# EAGLE schematic h-bridge2-smd-001 (EAGLE 7.2.0)
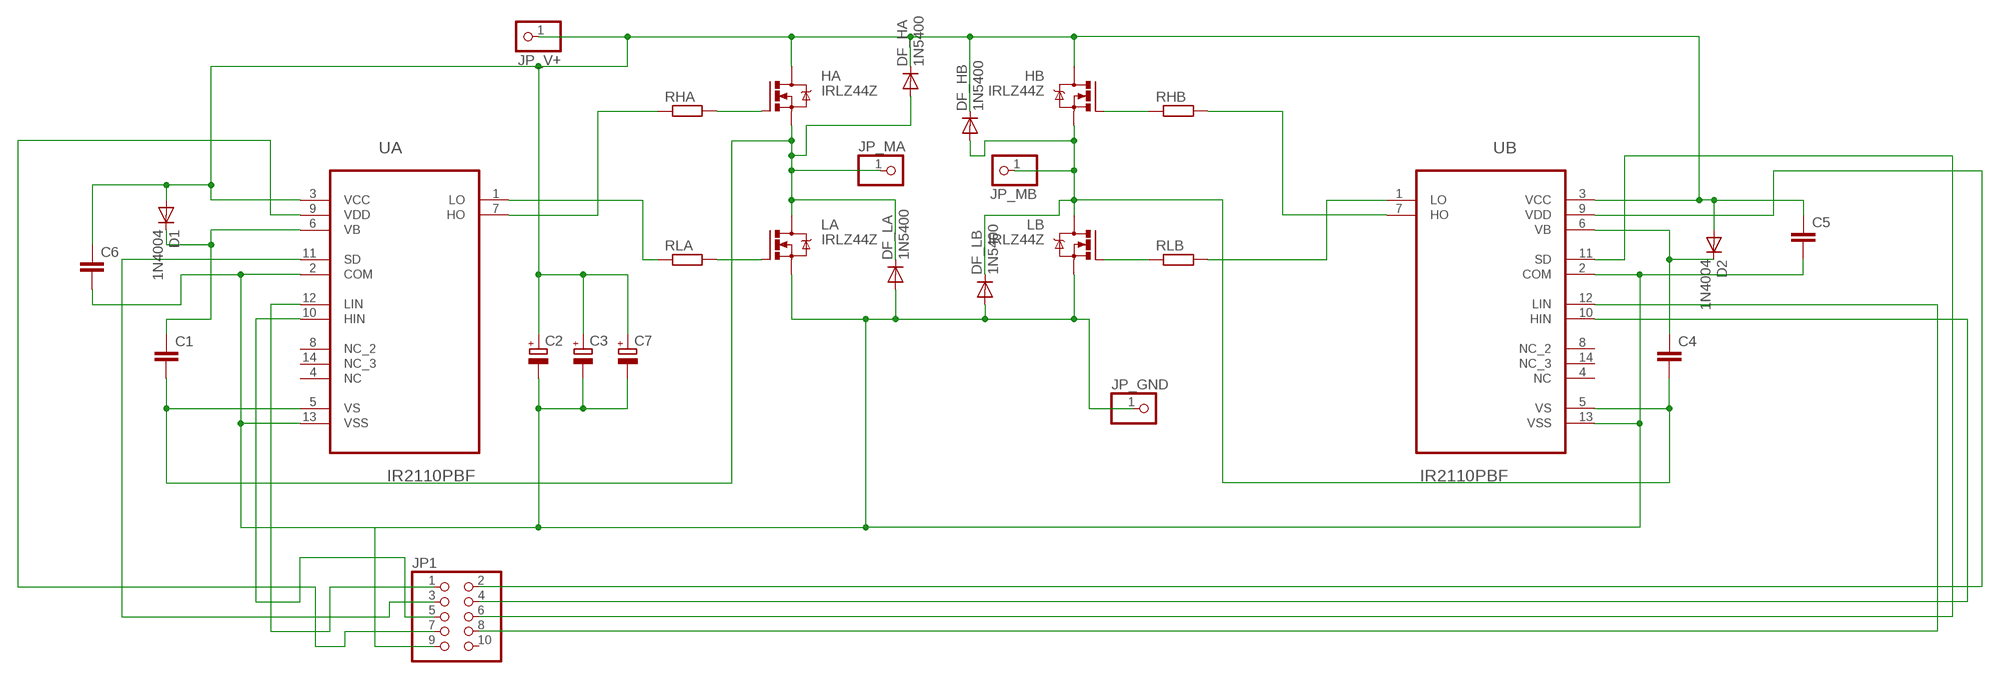
[diagram p0: schematic, sheet 1]

## Parts
C1  C-EU025-025X050  [C025-025X050]
C2  CPOL-EUE5-13  [E5-13]
C3  CPOL-EUE5-13  [E5-13]
C4  C-EU025-025X050  [C025-025X050]
C5  C-EU025-025X050  [C025-025X050]
C6  C-EU025-025X050  [C025-025X050]
C7  CPOL-EUE5-13  [E5-13]
D1  1N4004  [DO41-10]
D2  1N4004  [DO41-10]
DF_HA  1N5400  [DO201-15]
DF_HB  1N5400  [DO201-15]
DF_LA  1N5400  [DO201-15]
DF_LB  1N5400  [DO201-15]
HA  IRLZ44Z  [TO220BH]
HB  IRLZ44Z  [TO220BH]
JP1  PINHD-2X5  [2X05]
JP_GND  PINHD-1X1  [1X01]
JP_MA  PINHD-1X1  [1X01]
JP_MB  PINHD-1X1  [1X01]
JP_V+  PINHD-1X1  [1X01]
LA  IRLZ44Z  [TO220BH]
LB  IRLZ44Z  [TO220BH]
RHA  R-EU_0411/15  [0411/15]
RHB  R-EU_0411/15  [0411/15]
RLA  R-EU_0411/15  [0411/15]
RLB  R-EU_0411/15  [0411/15]
UA  IR2110PBF  [DIP254P762X533-14]
UB  IR2110PBF  [DIP254P762X533-14]

## Nets
N$4: C2.- C3.- C5.2 C6.2 C7.- DF_LA.A DF_LB.A JP1.9 JP_GND.1 LA.S LB.S UA.2(COM) UA.13(VSS) UB.2(COM) UB.13(VSS)
N$5: LA.G RLA.2
N$6: HA.G RHA.2
N$7: HB.G RHB.1
N$8: LB.G RLB.1
N$9: RHA.1 UA.7(HO)
N$10: RLA.1 UA.1(LO)
N$11: RHB.2 UB.7(HO)
N$12: RLB.2 UB.1(LO)
N$13: C2.+ C3.+ C5.1 C6.1 C7.+ D1.A D2.A DF_HA.C DF_HB.C HA.D HB.D JP_V+.1 UA.3(VCC) UB.3(VCC)
N$14: C1.1 D1.C UA.6(VB)
N$16: C4.2 DF_HB.A DF_LB.C HB.S JP_MB.1 LB.D UB.5(VS)
N$17: C1.2 DF_HA.A DF_LA.C HA.S JP_MA.1 LA.D UA.5(VS)
N$18: C4.1 D2.C UB.6(VB)
N$20: JP1.3 UA.11(SD)
N$22: JP1.7 UA.9(VDD)
N$23: JP1.5 UA.10(HIN)
N$24: JP1.1 UA.12(LIN)
N$25: JP1.2 UB.9(VDD)
N$26: JP1.4 UB.10(HIN)
N$27: JP1.6 UB.11(SD)
N$28: JP1.8 UB.12(LIN)
Unconnected: JP1.10 UA.4(NC) UA.8(NC_2) UA.14(NC_3) UB.4(NC) UB.8(NC_2) UB.14(NC_3)

## Library data of the parts
C1 C4-C6 = rcl:C-EU: CAPACITOR, European symbol
C2 C3 C7 = rcl:CPOL-EU: POLARIZED CAPACITOR, European symbol
D1 D2 = diode:1N4004: DIODE general purpose rectifier, 1 A
DF_HA DF_HB DF_LA DF_LB = dbg-misc:1N5400: DIODE standard rectifier, 3 A, 50 V (Motorola)
HA HB LA LB = transistor-power:IRLZ44Z: N-Channel HEXFET® Power MOSFET Logic Level AUTOMOTIVE MOSFET Source: http://www.irf.com/product-info/datasheets/data/irlz44zpbf.pdf
JP1 = pinhead:PINHD-2X5: PIN HEADER
JP_GND JP_MA JP_MB JP_V+ = dbg-misc:PINHD-1X1: PIN HEADER
RHA RHB RLA RLB = rcl:R-EU_: RESISTOR, European symbol
UA UB = ir2110:IR2110PBF: HIGH AND LOW SIDE DRIVER; MPN: IR2110PBF; OC_FARNELL: 8638837; OC_NEWARK: 63J7859; PACKAGE: PDIP-14; SUPPLIER: INTERNATIONAL RECTIFIER